# Altium schematic sheet BMP280.SchDoc: =GlobalProjectName
size A4; ApprovedBy: Утвердил; CheckedBy: Проверил; Author: Разработал; SheetNumber: 2; SheetTotal: 10; PageSetup: Record=PageOptions|CenterHorizontal=True|CenterVertical=True|PrintScale=1.00|XCorrection=1.00|YCorrection=1.00|PrintKind=1|BorderSize=5000000|LeftOffset=0|BottomOffset=0|Orientation=2|PaperLength=1000|PaperWidth=1000|Scale=100|PaperSource=15|PrintQuality=1200|MediaType=1|DitherType=10|PaperKind=A3|PrintScaleMode=1; Weight: -; ScaleFactor: -; NormInspection: Норм.Контр.
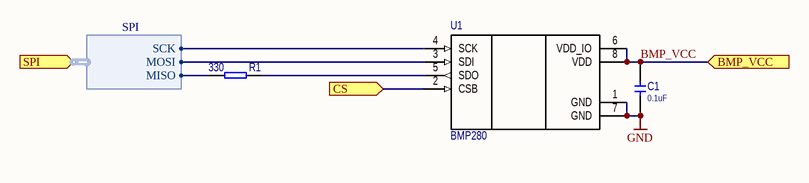
[diagram p0: BMP280.SchDoc]

## Parts
C1  value 0.1uF  [CERCAP 0402]
R1  value 330  [RES 0402]
U1  BMP280  [LGA8_BMP280]

## Ports
BMP_VCC (in), CS (in), SPI (in, harness SPI)

## Harnesses
SPI: SCK, MOSI, MISO

## Nets
GND: C1.1 U1.1(GND) U1.7(GND)
BMP_VCC: C1.2 U1.6(VDD_IO) U1.8(VDD) ; port BMP_VCC
CS: U1.2(CSB) ; port CS
NetR1_1: R1.1 ; port SPI.MISO
NetR1_2: R1.2 U1.5(SDO)
NetU1_3: U1.3(SDI) ; port SPI.MOSI
NetU1_4: U1.4(SCK) ; port SPI.SCK

## Notes on the sheet
- Title
- Size:
- Date:
- A4
- Number:
- Time:
- Revision:
- Sheet
- of
- File:

## Library data of the parts
C1 = !Capacitor: Capacitor; IsSMT: NoSMT; Diel: X7R; Voltage: *
R1 = !Resistor: Resistor; IsSMT: NoSMT
U1 = BMP(E)280: Temp/Pres/Hum